# Altium schematic sheet WCcircuit.SchDoc
size A4
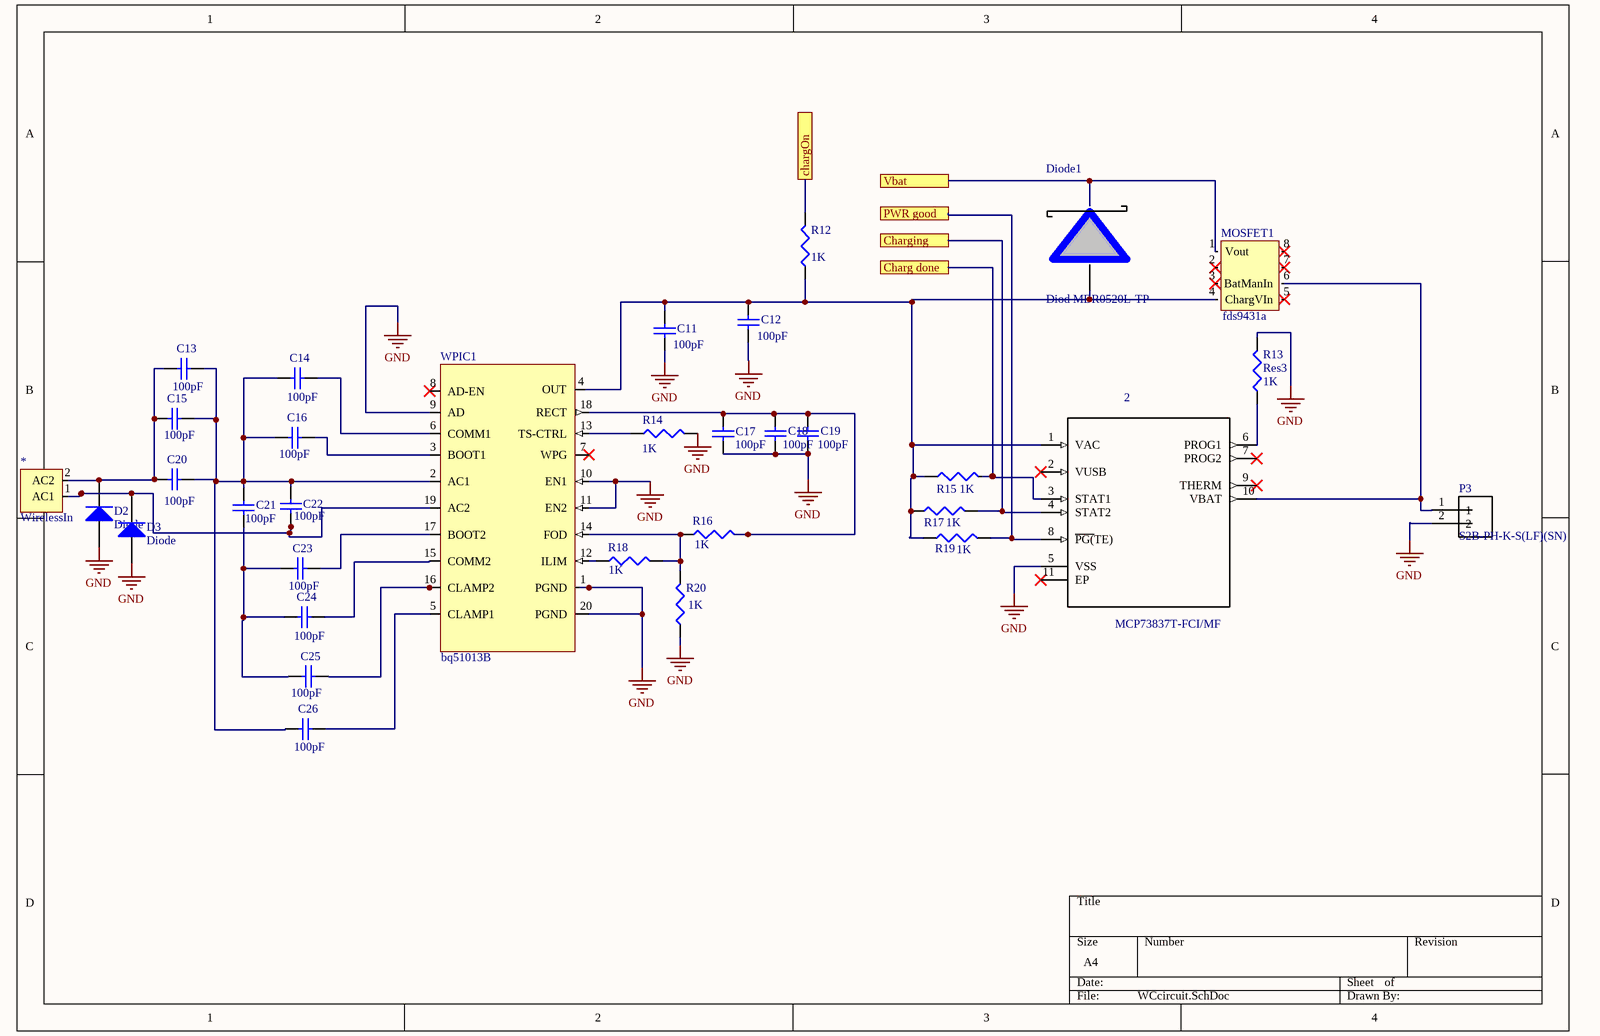
[diagram p0: WCcircuit.SchDoc]

## Parts
2  MCP73837T-FCI/MF  [DFN300X300X100-11N]
*  WirelessIn  [WirelessIn]
C11  value 100pF  [C1206]  (hidden comment: Cap Semi)
C12  value 100pF  [C1206]  (hidden comment: Cap Semi)
C13  value 100pF  [C1206]  (hidden comment: Cap Semi)
C14  value 100pF  [C1206]  (hidden comment: Cap Semi)
C15  value 100pF  [C1206]  (hidden comment: Cap Semi)
C16  value 100pF  [C1206]  (hidden comment: Cap Semi)
C17  value 100pF  [C1206]  (hidden comment: Cap Semi)
C18  value 100pF  [C1206]  (hidden comment: Cap Semi)
C19  value 100pF  [C1206]  (hidden comment: Cap Semi)
C20  value 100pF  [C1206]  (hidden comment: Cap Semi)
C21  value 100pF  [C1206]  (hidden comment: Cap Semi)
C22  value 100pF  [C1206]  (hidden comment: Cap Semi)
C23  value 100pF  [C1206]  (hidden comment: Cap Semi)
C24  value 100pF  [C1206]  (hidden comment: Cap Semi)
C25  value 100pF  [C1206]  (hidden comment: Cap Semi)
C26  value 100pF  [C1206]  (hidden comment: Cap Semi)
D2  Diode  [SMC]
D3  Diode  [SMC]
Diode1  Diod MBR0520L-TP  [SOD3716X135N]
MOSFET1  fds9431a  [SOIC127P600X175-8N]
P3  S2B-PH-K-S(LF)(SN)  [JST_S2B-PH-K-S(LF)(SN)]
R12  value 1K  [J1-0603]  (hidden comment: Res3)
R13  Res3  value 1K  [J1-0603]
R14  value 1K  [J1-0603]  (hidden comment: Res3)
R15  value 1K  [J1-0603]  (hidden comment: Res3)
R16  value 1K  [J1-0603]  (hidden comment: Res3)
R17  value 1K  [J1-0603]  (hidden comment: Res3)
R18  value 1K  [J1-0603]  (hidden comment: Res3)
R19  value 1K  [J1-0603]  (hidden comment: Res3)
R20  value 1K  [J1-0603]  (hidden comment: Res3)
WPIC1  bq51013B  [CONTROLLER_MSP430FR2522IRHLT]

## Ports
Charg done, Charging, chargOn, PWR good, Vbat

## Nets
GND: 2.5(VSS) C11.1 C12.1 C17.1 C18.1 C19.1 D2.1(A) D3.1(A) P3.2 R13.2 R14.2 R20.1 WPIC1.1(PGND) WPIC1.9(AD) WPIC1.10(EN1) WPIC1.11(EN2) WPIC1.20(PGND)
Charg done: 2.3(STAT1) R15.2 ; port Charg done
Charging: 2.4(STAT2) R17.2 ; port Charging
chargOn: R12.2 ; port chargOn
PWR good: 2.8(~{PG(}TE)) R19.2 ; port PWR good
Vbat: Diode1.C MOSFET1.1(Vout) ; port Vbat
Net2_1: 2.1(VAC) C11.2 C12.2 Diode1.A MOSFET1.4(ChargVIn) R12.1 R15.1 R17.1 R19.1 WPIC1.4(OUT)
Net2_6: 2.6(PROG1) R13.1
Net2_10: 2.10(VBAT) MOSFET1.6(BatManIn) P3.1
Net*_1: *.1(AC1) C22.1 D3.2(K) WPIC1.19(AC2)
Net*_2: *.2(AC2) C13.1 C15.1 C20.1 D2.2(K)
NetC13_2: C13.2 C14.1 C15.2 C16.1 C20.2 C21.2 C22.2 C26.1 WPIC1.2(AC1)
NetC14_2: C14.2 WPIC1.6(COMM1)
NetC16_2: C16.2 WPIC1.3(BOOT1)
NetC17_2: C17.2 C18.2 C19.2 R16.2 WPIC1.18(RECT)
NetC21_1: C21.1 C23.1 C24.1 C25.1
NetC23_2: C23.2 WPIC1.17(BOOT2)
NetC24_2: C24.2 WPIC1.15(COMM2)
NetC25_2: C25.2 WPIC1.16(CLAMP2)
NetC26_2: C26.2 WPIC1.5(CLAMP1)
NetR14_1: R14.1 WPIC1.13(TS-CTRL)
NetR16_1: R16.1 R18.2 R20.2 WPIC1.14(FOD)
NetR18_1: R18.1 WPIC1.12(ILIM)

Not connected (* = marked no-connect by the designer): 2 2(VUSB)* 7(PROG2)* 9(THERM)* 11(EP)*; MOSFET1 2(22)* 3(23)* 5(22)* 7(22)* 8(22)*; WPIC1 7(WPG)* 8(AD-EN)*

## Notes on the sheet
- (in symbol MCP73837T-FCI/MF) Text

## Library data of the parts
2 = MCP73837T-FCI/MF: MCP73837 Series 6 V Linear Battery Charge Controller Surface Mount - DFN-10; MF: Microchip; Package: DFN-10 Microchip; SnapEDA_Link: https://www.snapeda.com/symbols-footprints/MCP73837T-FCI/MF/Microchip/view-part/?ref=snap; MP: MCP73837T-FCI/MF; Availability: Good; Price: 0.98 USD; Value: *
C11-C26 = Cap Semi: Capacitor (Semiconductor SIM Model); Published: 8-Jun-2000; LatestRevisionDate: 29-May-2009; LatestRevisionNote: IPC-7351 Footprint Added.; PackageReference: C1206; Publisher: Altium Limited; PackageDescription: Chip Capacitor
D2 D3 = Diode: Default Diode; Published: 8-Jun-2000; LatestRevisionDate: 17-Jul-2002; LatestRevisionNote: Re-released for DXP Platform.; PackageVersion: Sep-1996; PackageReference: SMC; Publisher: Altium Limited; PackageDescription: DO-214-AB/SMC; 2 C-Bend Leads; Body 7.9 x 5.9 mm, inc. leads (LxW); Code_JEDEC: DO-214-AB
P3 = S2B-PH-K-S(LF)(SN): Header Side Entry 2way; MF: JST; SnapEDA_Link: https://www.snapeda.com/symbols-footprints/S2B-PH-K-S%20%28LF%29%28SN%29/JST/view-part/?ref=snap; Availability: Good; Package: None; Price: 0.12 USD; MP: S2B-PH-K-S (LF)(SN); Value: *
R12-R20 = Res3: Resistor; Published: 8-Jun-2000; LatestRevisionDate: 29-May-2009; LatestRevisionNote: IPC-7351 Footprint Added.; PackageReference: J1-0603; Publisher: Altium Limited; PackageDescription: Chip Resistor